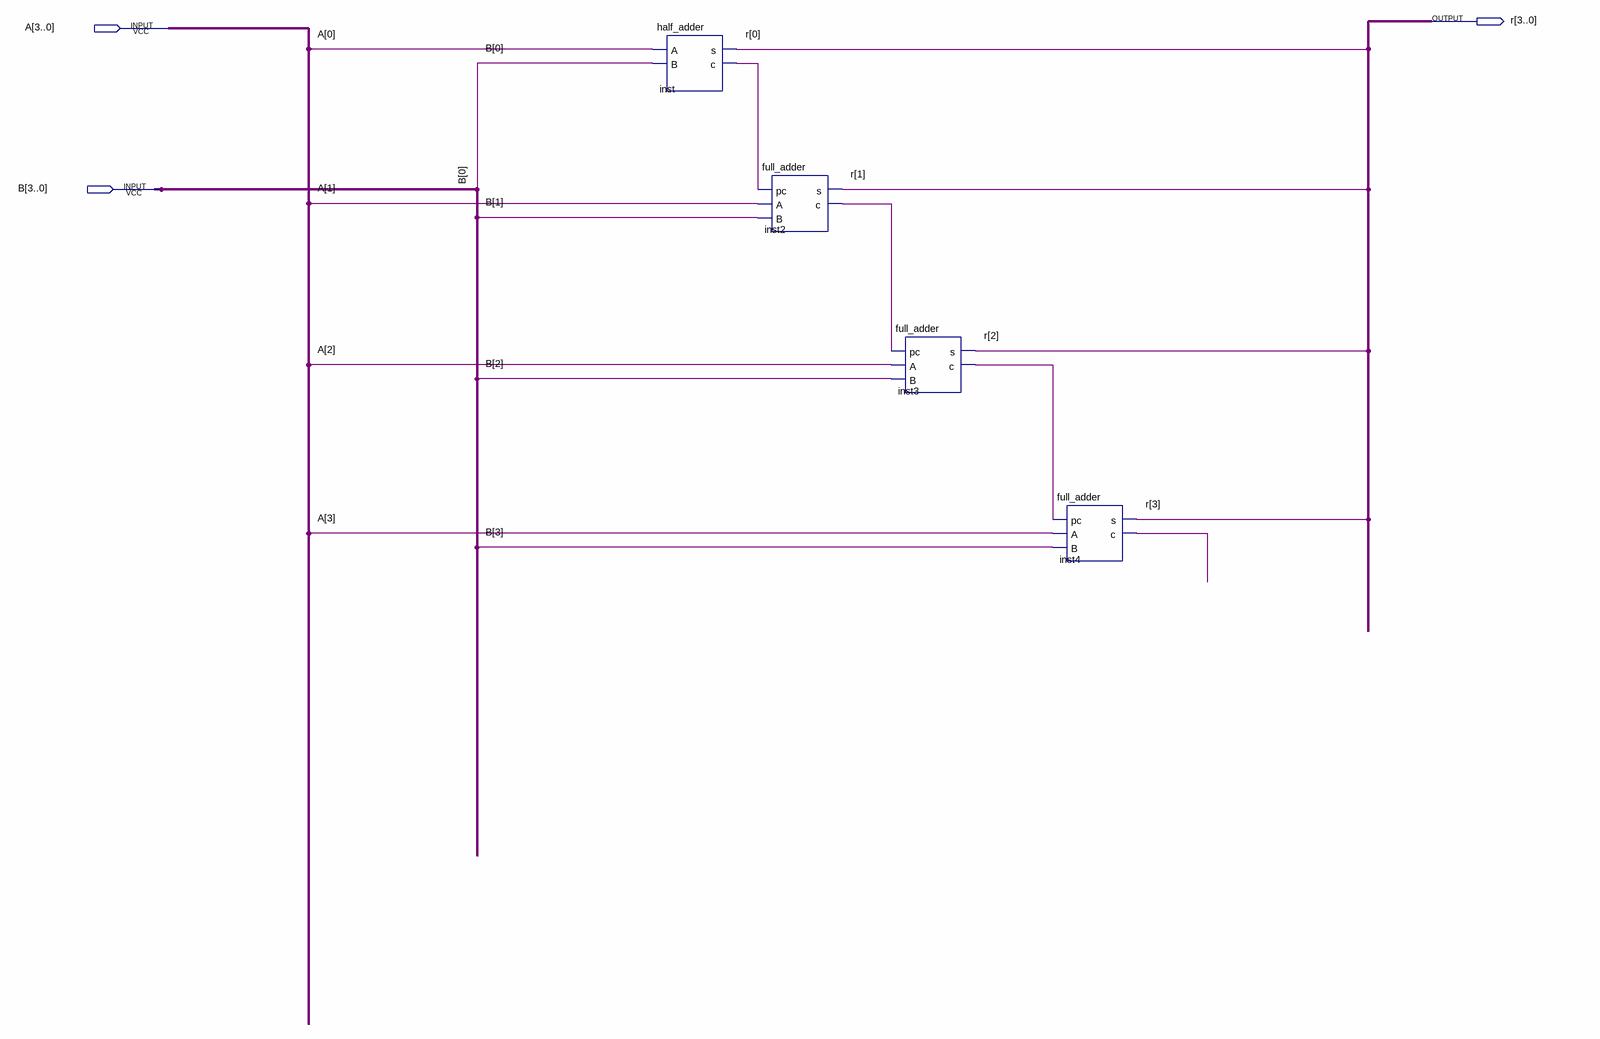
[diagram p0: schematic sheet]
// Quartus schematic bit4adder.bdf as structural Verilog: 4 symbols, 3 pins
module bit4adder (
  input  [3:0] A,
  input  [3:0] B,
  output [3:0] r
);

  wire inst2_c, inst3_c, inst4_c, inst_c;

  half_adder inst (.A(A[0]), .B(B[0]), .s(r[0]), .c(inst_c));
  full_adder inst2 (.pc(inst_c), .A(A[1]), .B(B[1]), .s(r[1]), .c(inst2_c));
  full_adder inst3 (.pc(inst2_c), .A(A[2]), .B(B[2]), .s(r[2]), .c(inst3_c));
  full_adder inst4 (.pc(inst3_c), .A(A[3]), .B(B[3]), .s(r[3]), .c(inst4_c));
endmodule
